# Altium project DRL.PRJPCB
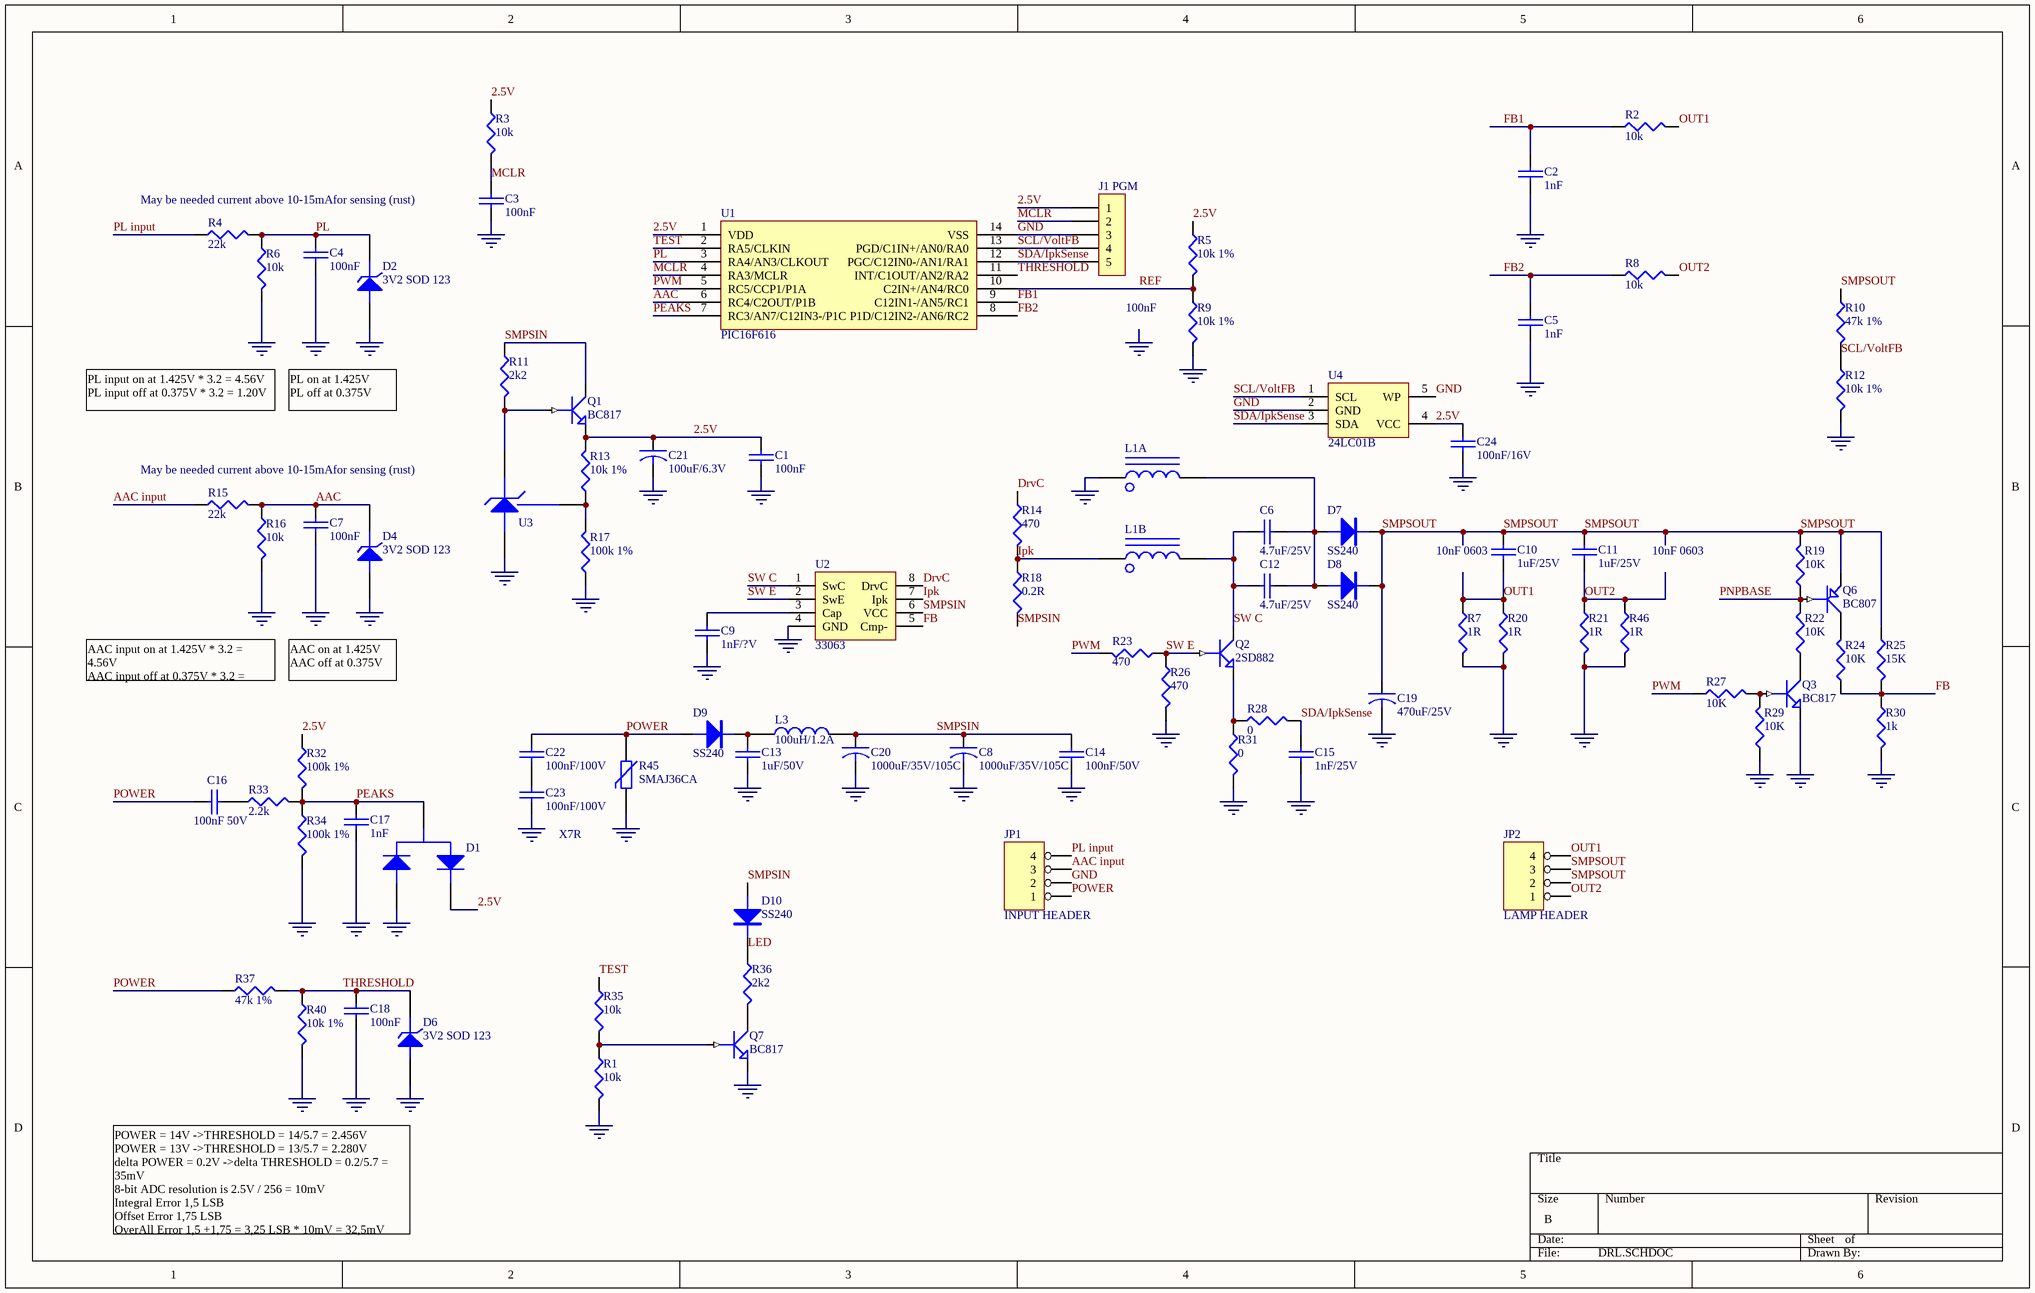
[diagram p0: DRL.SCHDOC]
2 sheets, 94 parts. Net scope: global (net labels, ports and power ports of the same name join across sheets).
Board file: DRL.PCBDOC
Sheets:
  DRL.SCHDOC
  Templates.SCHDOC

## Sheet DRL.SCHDOC
size B

### Parts
C1  100nF  [0603]
C2  1nF  [0603]
C3  100nF  [0603]
C4  100nF  [0603]
C5  1nF  [0603]
C6  4.7uF/25V  [0805]
C7  100nF  [0603]
C8  1000uF/35V/105C  [RA 13mm]
C9  1nF/?V  [0603]
C10  1uF/25V  [0805]
C11  1uF/25V  [0805]
C12  4.7uF/25V  [0805]
C13  1uF/50V  [0805]
C14  100nF/50V  [0603]
C15  1nF/25V  [0603]
C16  100nF 50V  [0805]
C17  1nF  [0603]
C18  100nF  [0603]
C19  470uF/25V  [CS 10.3]
C20  1000uF/35V/105C  [RA 13mm]
C21  100uF/6.3V  [CS 6.6]
C22  100nF/100V  [0603]
C23  100nF/100V  [0603]
C24  100nF/16V  [0603]
D1  DUAL DIODE BAV99  [SOT-23]  (value not drawn)
D2  3V2 SOD 123  [SOD 123]
D4  3V2 SOD 123  [SOD 123]
D6  3V2 SOD 123  [SOD 123]
D7  SS240  [SMA]
D8  SS240  [SMA]
D9  SS240  [SMA]
D10  SS240  [SIP2]
J1  PGM  [SIP5 1.27]
JP1  INPUT HEADER  [SIP4 5.1]
JP2  LAMP HEADER  [SIP4 4.0]
L1  (no value)  [DUAL IND]  (parts A,B of 2)
L3  100uH/1.2A  [IND SINGLE]
Q1  BC817  [SOT-23]
Q2  2SD882  [SOT-89]
Q3  BC817  [SOT-23]
Q6  BC807  [SOT-23]
Q7  BC817  [SOT-23]
R1  10k  [0603]
R2  10k  [0603]
R3  10k  [0603]
R4  22k  [0805]
R5  10k 1%  [0603]
R6  10k  [0603]
R7  1R  [1206]
R8  10k  [0603]
R9  10k 1%  [0603]
R10  47k 1%  [0603]
R11  2k2  [0603]
R12  10k 1%  [0603]
R13  10k 1%  [0603]
R14  470  [0603]
R15  22k  [0805]
R16  10k  [0603]
R17  100k 1%  [0603]
R18  0.2R  [1206]
R19  10K  [0603]
R20  1R  [1206]
R21  1R  [1206]
R22  10K  [0603]
R23  470  [0603]
R24  10K  [0603]
R25  15K  [0603]
R26  470  [0603]
R27  10K  [0603]
R28  0  [0603]
R29  10K  [0603]
R30  1k  [0603]
R31  0  [1206]
R32  100k 1%  [0603]
R33  2.2k  [0603]
R34  100k 1%  [0603]
R35  10k  [0603]
R36  2k2  [0805]
R37  47k 1%  [0603]
R40  10k 1%  [0603]
R45  SMAJ36CA  [SMA]
R46  1R  [1206]
U1  PIC16F616  [SO-14]
U2  33063  [SO-8]
U3  TL431  [SOT-23]  (value not drawn)
U4  24LC01B  [SOT23 - 5]

### Nets
GND: C1.2 C2.2 C3.2 C4.2 C5.2 C7.2 C8.2 C9.2 C13.2 C14.2 C15.2 C17.2 C18.2 C19.2 C20.2 C21.2 C23.2 C24.2 D1.1(A) D2.1(A) D4.1(A) D6.1(A) J1.3 JP1.2 L1.1 Q3.3(E) Q7.3(E) R1.2 R6.2 R7.2 R9.2 R12.2 R16.2 R17.1 R20.2 R21.2 R26.2 R29.1 R30.2 R31.2 R34.2 R40.2 R45.K R46.2 U1.14(VSS) U2.4(GND) U3.2(A) U4.2(GND) U4.5(WP)
2.5V: C1.1 C21.1 C24.1 D1.3(K) J1.1 Q1.3(E) R3.1 R5.1 R13.2 R32.1 U1.1(VDD) U4.4(VCC)
AAC: C7.1 D4.2(K) R15.2 R16.1 U1.6(RC4/C2OUT/P1B)
AAC input: JP1.3 R15.1
DrvC: R14.1 U2.8(DrvC)
FB: R24.1 R25.2 R30.1 U2.5(Cmp-)
FB1: C2.1 R2.1 U1.9(C12IN1-/AN5/RC1)
FB2: C5.1 R8.1 U1.8(P1D/C12IN2-/AN6/RC2)
Ipk: L1.2 R14.2 R18.1 U2.7(Ipk)
LED: D10.2(K) R36.1
MCLR: C3.1 J1.2 R3.2 U1.4(RA3/MCLR)
OUT1: C10.2 JP2.4 R2.2 R7.1 R20.1
OUT2: C11.2 JP2.1 R8.2 R21.1 R46.1
PEAKS: C17.1 D1.2(AK) R32.2 R33.2 R34.1 U1.7(RC3/AN7/C12IN3-/P1C)
PL: C4.1 D2.2(K) R4.2 R6.1 U1.3(RA4/AN3/CLKOUT)
PL input: JP1.4 R4.1
PNPBASE: Q6.1(B) R19.1 R22.2
POWER: C16.1 C22.1 D9.A JP1.1 R37.1 R45.A
PWM: R23.2 R27.1 U1.5(RC5/CCP1/P1A)
REF: R5.2 R9.1 U1.10(C2IN+/AN4/RC0)
SCL/VoltFB: J1.4 R10.2 R12.1 U1.13(PGD/C1IN+/AN0/RA0) U4.1(SCL)
SDA/IpkSense: C15.1 J1.5 R28.2 U1.12(PGC/C12IN0-/AN1/RA1) U4.3(SDA)
SMPSIN: C8.1 C14.1 C20.1 D10.1(A) L3.2 Q1.2(C) R11.1 R18.2 U2.6(VCC)
SMPSOUT: C10.1 C11.1 C19.1 D7.K D8.K JP2.2 JP2.3 Q6.3(E) R10.1 R19.2 R25.1
SW C: C6.1 C12.1 L1.4 Q2.2(C) U2.1(SwC)
SW E: Q2.1(B) R23.1 R26.1 U2.2(SwE)
TEST: R35.1 U1.2(RA5/CLKIN)
THRESHOLD: C18.1 D6.2(K) R37.2 R40.1 U1.11(INT/C1OUT/AN2/RA2)
NetC6_2: C6.2 C12.2 D7.A D8.A L1.3
NetC9_1: C9.1 U2.3(Cap)
NetC13_1: C13.1 D9.K L3.1
NetC16_2: C16.2 R33.1
NetC22_2: C22.2 C23.1
NetQ1_1: Q1.1(B) R11.2 U3.3(K)
NetQ2_3: Q2.3(E) R28.1 R31.1
NetQ3_1: Q3.1(B) R27.2 R29.2
NetQ3_2: Q3.2(C) R22.1
NetQ6_2: Q6.2(C) R24.2
NetQ7_1: Q7.1(B) R1.1 R35.2
NetQ7_2: Q7.2(C) R36.2
NetR13_1: R13.1 R17.2 U3.1(REF)

### Notes on the sheet
- May be needed current above 10-15mAfor sensing (rust)
- 100nF
- PL input on at 1.425V * 3.2 = 4.56V
  PL input off at 0.375V * 3.2 = 1.20V
- PL on at 1.425V
  PL off at 0.375V
- (near C10) 10nF 0603
- 10nF 0603
- AAC input on at 1.425V * 3.2 = 4.56V
  AAC input off at 0.375V * 3.2 = 1.20V
- AAC on at 1.425V
  AAC off at 0.375V
- (near C23) X7R
- POWER = 14V ->THRESHOLD = 14/5.7 = 2.456V
  POWER = 13V ->THRESHOLD = 13/5.7 = 2.280V
  delta POWER = 0.2V ->delta THRESHOLD = 0.2/5.7 = 35mV
  8-bit ADC resolution is 2.5V / 256 = 10mV
  Integral Error 1,5 LSB
  Offset Error 1,75 LSB
  OverAll Error 1,5 +1,75 = 3,25 LSB * 10mV = 32,5mV error
- Labels drawn without touching a wire or pin: GND

### Library data of the parts
C1-C7 C9-C18 C22-C24 = CAP: Capacitor
C8 C19-C21 = CAPACITOR
D2 D4 D6 = ZENER3: Zener Diode
D7-D10 = DIODE
J1 = CON5: Connector
JP1 JP2 = 4 HEADER: 4 Pin Header
L1 = INDICTOR SEPIC
L3 = INDUCTOR
Q1-Q3 Q7 = NPN1: NPN Transistor
Q6 = PNP1: PNP Transistor
R1-R37 R40 R46 = RES1
R45 = VARISTOR
U1 = PIC16F616: Microchip Microcontroller
U2 = 34063: DC/DC converter
U4 = MEMORY I2C SOT23

## Sheet Templates.SCHDOC
size B
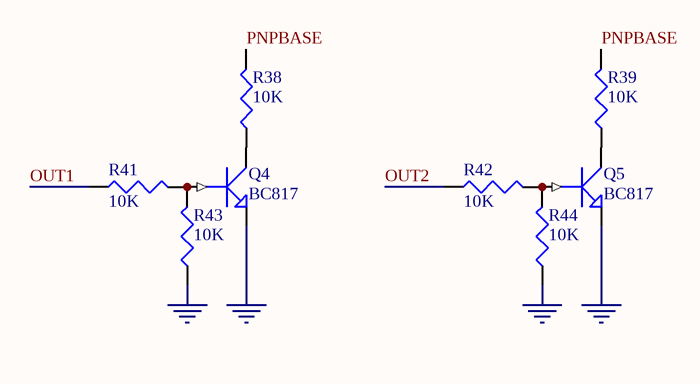
[diagram p1: Templates.SCHDOC]

### Parts
Q4  BC817  [SOT-23]
Q5  BC817  [SOT-23]
R38  10K  [0805]
R39  10K  [0805]
R41  10K  [0603]
R42  10K  [0805]
R43  10K  [0805]
R44  10K  [0805]

### Nets
GND: Q4.3(E) Q5.3(E) R43.1 R44.1
OUT1: R41.1
OUT2: R42.1
PNPBASE: R38.2 R39.2
NetQ4_1: Q4.1(B) R41.2 R43.2
NetQ4_2: Q4.2(C) R38.1
NetQ5_1: Q5.1(B) R42.2 R44.2
NetQ5_2: Q5.2(C) R39.1

### Library data of the parts
Q4 Q5 = NPN1: NPN Transistor
R38 R39 R41-R44 = RES1

## Nets that join several sheets
GND: DRL (49 pins), Templates (Q4.3 Q5.3 R43.1 R44.1)
OUT1: DRL (5 pins), Templates (R41.1)
OUT2: DRL (5 pins), Templates (R42.1)
PNPBASE: DRL (Q6.1 R19.1 R22.2), Templates (R38.2 R39.2)